# Altium schematic sheet eps_pay.SchDoc
size A4
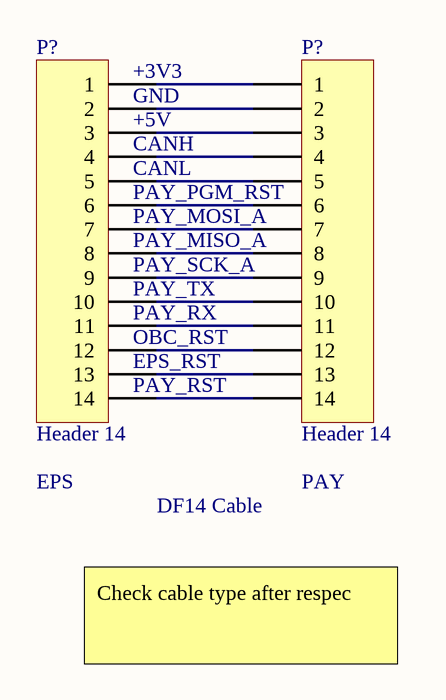
[diagram p0: eps_pay.SchDoc]

## Parts
(Parts that share a designator on the sheet are numbered #1, #2 ... from top to bottom, then left to right.)
P?#1  Header 14  [HDR1X14]
P?#2  Header 14  [HDR1X14]

## Nets
NetP?#1_1: P?#1.1 P?#2.1
NetP?#1_2: P?#1.2 P?#2.2
NetP?#1_3: P?#1.3 P?#2.3
NetP?#1_4: P?#1.4 P?#2.4
NetP?#1_5: P?#1.5 P?#2.5
NetP?#1_6: P?#1.6 P?#2.6
NetP?#1_7: P?#1.7 P?#2.7
NetP?#1_8: P?#1.8 P?#2.8
NetP?#1_9: P?#1.9 P?#2.9
NetP?#1_10: P?#1.10 P?#2.10
NetP?#1_11: P?#1.11 P?#2.11
NetP?#1_12: P?#1.12 P?#2.12
NetP?#1_13: P?#1.13 P?#2.13
NetP?#1_14: P?#1.14 P?#2.14

## Notes on the sheet
- (near P?#1) +3V3
- (near P?#1) GND
- (near P?#1) +5V
- (near P?#1) CANH
- (near P?#1) CANL
- (near P?#1) PAY_TX
- (near P?#1) PAY_PGM_RST
- (near P?#1) PAY_MOSI_A
- (near P?#1) PAY_MISO_A
- (near P?#1) PAY_SCK_A
- (near P?#1) OBC_RST
- (near P?#1) EPS_RST
- (near P?#1) PAY_RST
- (near P?#1) PAY_RX
- (near P?#1) EPS
- DF14 Cable
- (near P?#2) PAY
- Check cable type after respec

## Library data of the parts
P?#1 P?#2 = Header 14: Header, 14-Pin; LatestRevisionDate: 17-Jul-2002; LatestRevisionNote: Re-released for DXP Platform.; Publisher: Altium Limited